# Altium schematic sheet [05] - MINIPCICONN.SchDoc
size A2
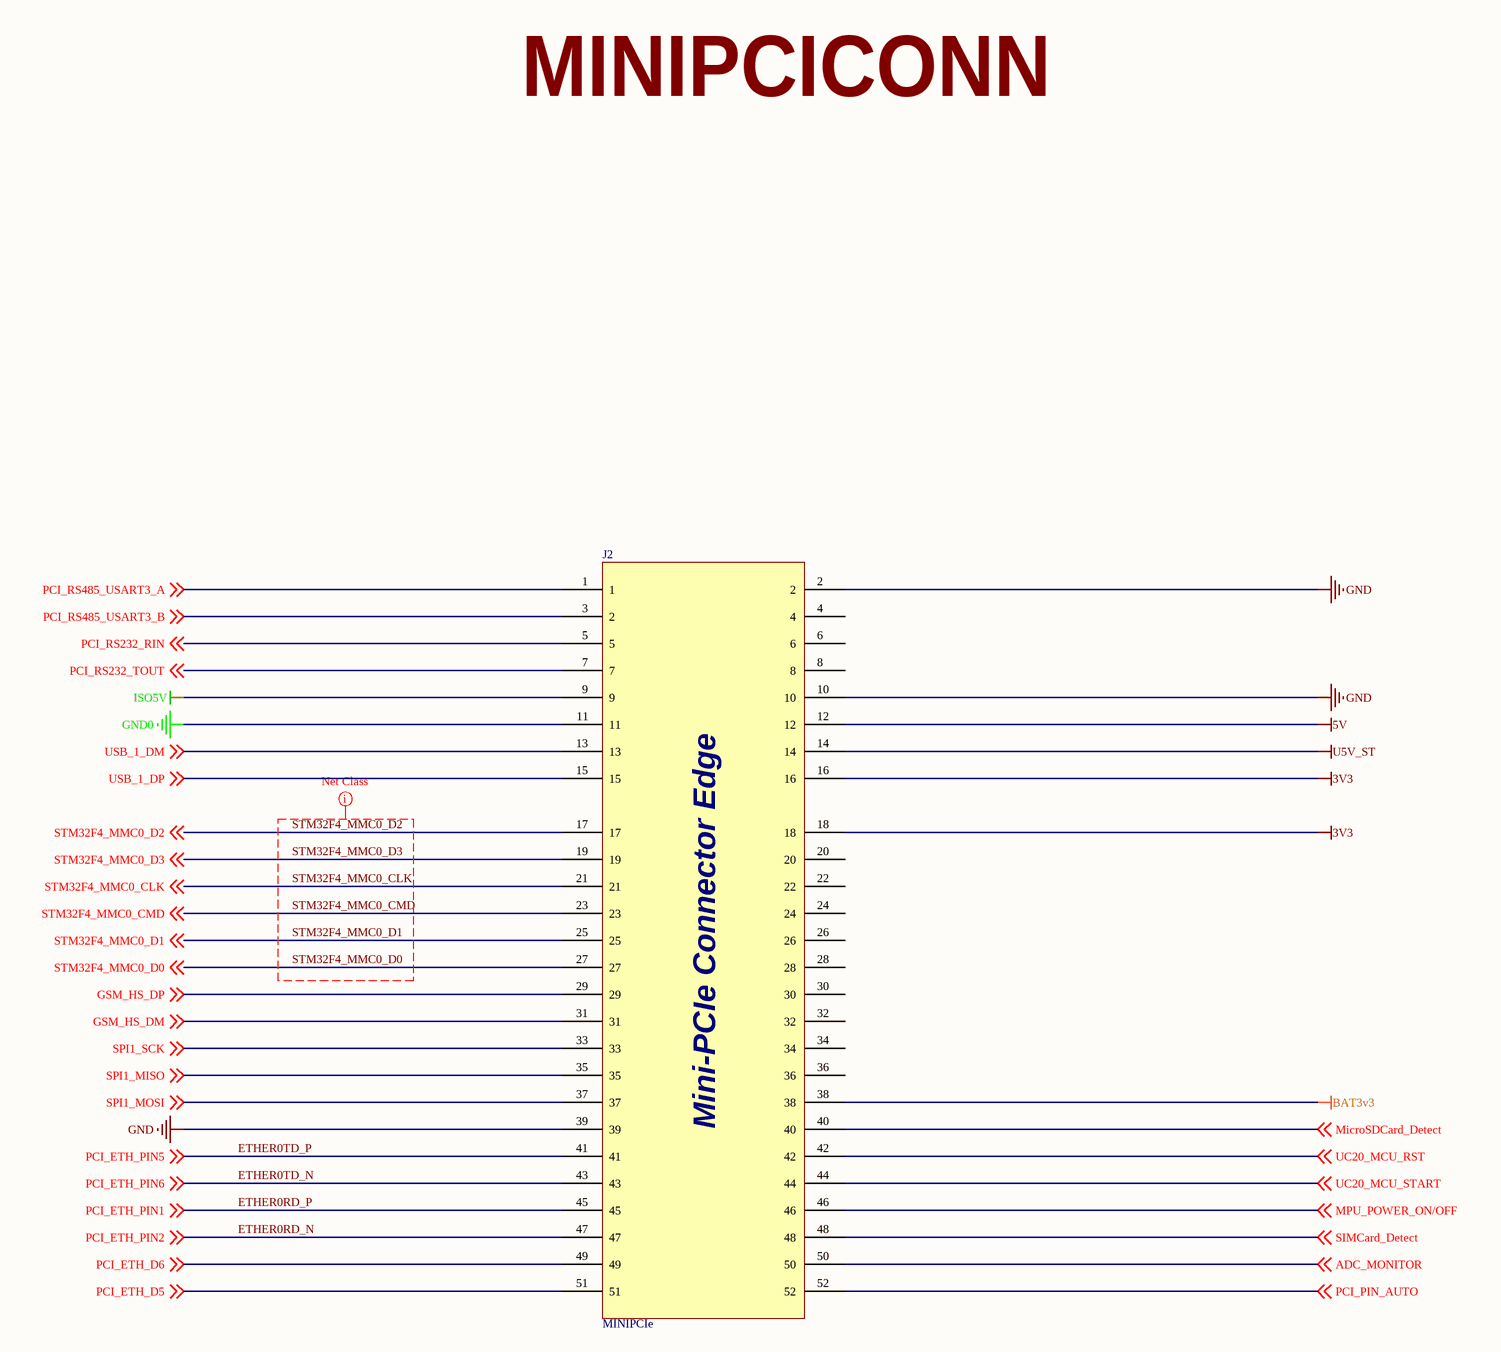
[diagram p0: [05] - MINIPCICONN.SchDoc]

## Parts
J2  MINIPCIe  [MINI PCIe]

## Nets
3V3: J2.16 J2.18
5V: J2.12
BAT3v3: J2.38
GND: J2.2 J2.10 J2.39
GND0: J2.11
ISO5V: J2.9
U5V_ST: J2.14
ADC_MONITOR: J2.50 ; off-sheet ADC_MONITOR
ETHER0RD_N: J2.47 ; off-sheet PCI_ETH_PIN2  [also labelled PCI_ETH_PIN2]
ETHER0RD_P: J2.45 ; off-sheet PCI_ETH_PIN1  [also labelled PCI_ETH_PIN1]
ETHER0TD_N: J2.43 ; off-sheet PCI_ETH_PIN6  [also labelled PCI_ETH_PIN6]
ETHER0TD_P: J2.41 ; off-sheet PCI_ETH_PIN5  [also labelled PCI_ETH_PIN5]
GSM_HS_DM: J2.31 ; off-sheet GSM_HS_DM
GSM_HS_DP: J2.29 ; off-sheet GSM_HS_DP
MicroSDCard_Detect: J2.40 ; off-sheet MicroSDCard_Detect
MPU_POWER_ON/OFF: J2.46 ; off-sheet MPU_POWER_ON/OFF
PCI_ETH_D5: J2.51 ; off-sheet PCI_ETH_D5
PCI_ETH_D6: J2.49 ; off-sheet PCI_ETH_D6
PCI_PIN_AUTO: J2.52 ; off-sheet PCI_PIN_AUTO
PCI_RS232_RIN: J2.5 ; off-sheet PCI_RS232_RIN
PCI_RS232_TOUT: J2.7 ; off-sheet PCI_RS232_TOUT
PCI_RS485_USART3_A: J2.1 ; off-sheet PCI_RS485_USART3_A
PCI_RS485_USART3_B: J2.3(2) ; off-sheet PCI_RS485_USART3_B
SIMCard_Detect: J2.48 ; off-sheet SIMCard_Detect
SPI1_MISO: J2.35 ; off-sheet SPI1_MISO
SPI1_MOSI: J2.37 ; off-sheet SPI1_MOSI
SPI1_SCK: J2.33 ; off-sheet SPI1_SCK
STM32F4_MMC0_CLK: J2.21 ; off-sheet STM32F4_MMC0_CLK
STM32F4_MMC0_CMD: J2.23 ; off-sheet STM32F4_MMC0_CMD
STM32F4_MMC0_D0: J2.27 ; off-sheet STM32F4_MMC0_D0
STM32F4_MMC0_D1: J2.25 ; off-sheet STM32F4_MMC0_D1
STM32F4_MMC0_D2: J2.17 ; off-sheet STM32F4_MMC0_D2
STM32F4_MMC0_D3: J2.19 ; off-sheet STM32F4_MMC0_D3
UC20_MCU_RST: J2.42 ; off-sheet UC20_MCU_RST
UC20_MCU_START: J2.44 ; off-sheet UC20_MCU_START
USB_1_DM: J2.13 ; off-sheet USB_1_DM
USB_1_DP: J2.15 ; off-sheet USB_1_DP

Not connected (* = marked no-connect by the designer): J2 4 6 8 20 22 24 26 28 30 32 34 36

## Layout directives
net class MMC_SD: STM32F4_MMC0_CLK, STM32F4_MMC0_CMD, STM32F4_MMC0_D0, STM32F4_MMC0_D1, STM32F4_MMC0_D2, STM32F4_MMC0_D3

## Notes on the sheet
- MINIPCICONN
- (in symbol MINIPCIe) Mini-PCIe Connector Edge